# Altium project HVAMP_8CH.PrjPCB (part 2 of 3)

## Sheet power_supplies_HVAMP.SchDoc: HVAMP
size 420 x 297 mm; Author: G.Kasprowicz; CompanyName: WUT ISE; DrawnBy: G.Kasprowicz; Organization: WUT ISE; Address1: PW ISE; Address2: Nowowiejska 15/19 00-665 Warsaw; Address3: gkasprow@gmail.com; DocumentNumber: 4; Revision: 2; SheetNumber: 4; SheetTotal: 5; ModifiedBy: -; CheckedDate: -; Title2: Power supply; DivGrp: WUT ISE; Designer: G.Kasprowicz; ModifiedDate: -; ProjectName: Sensor Box
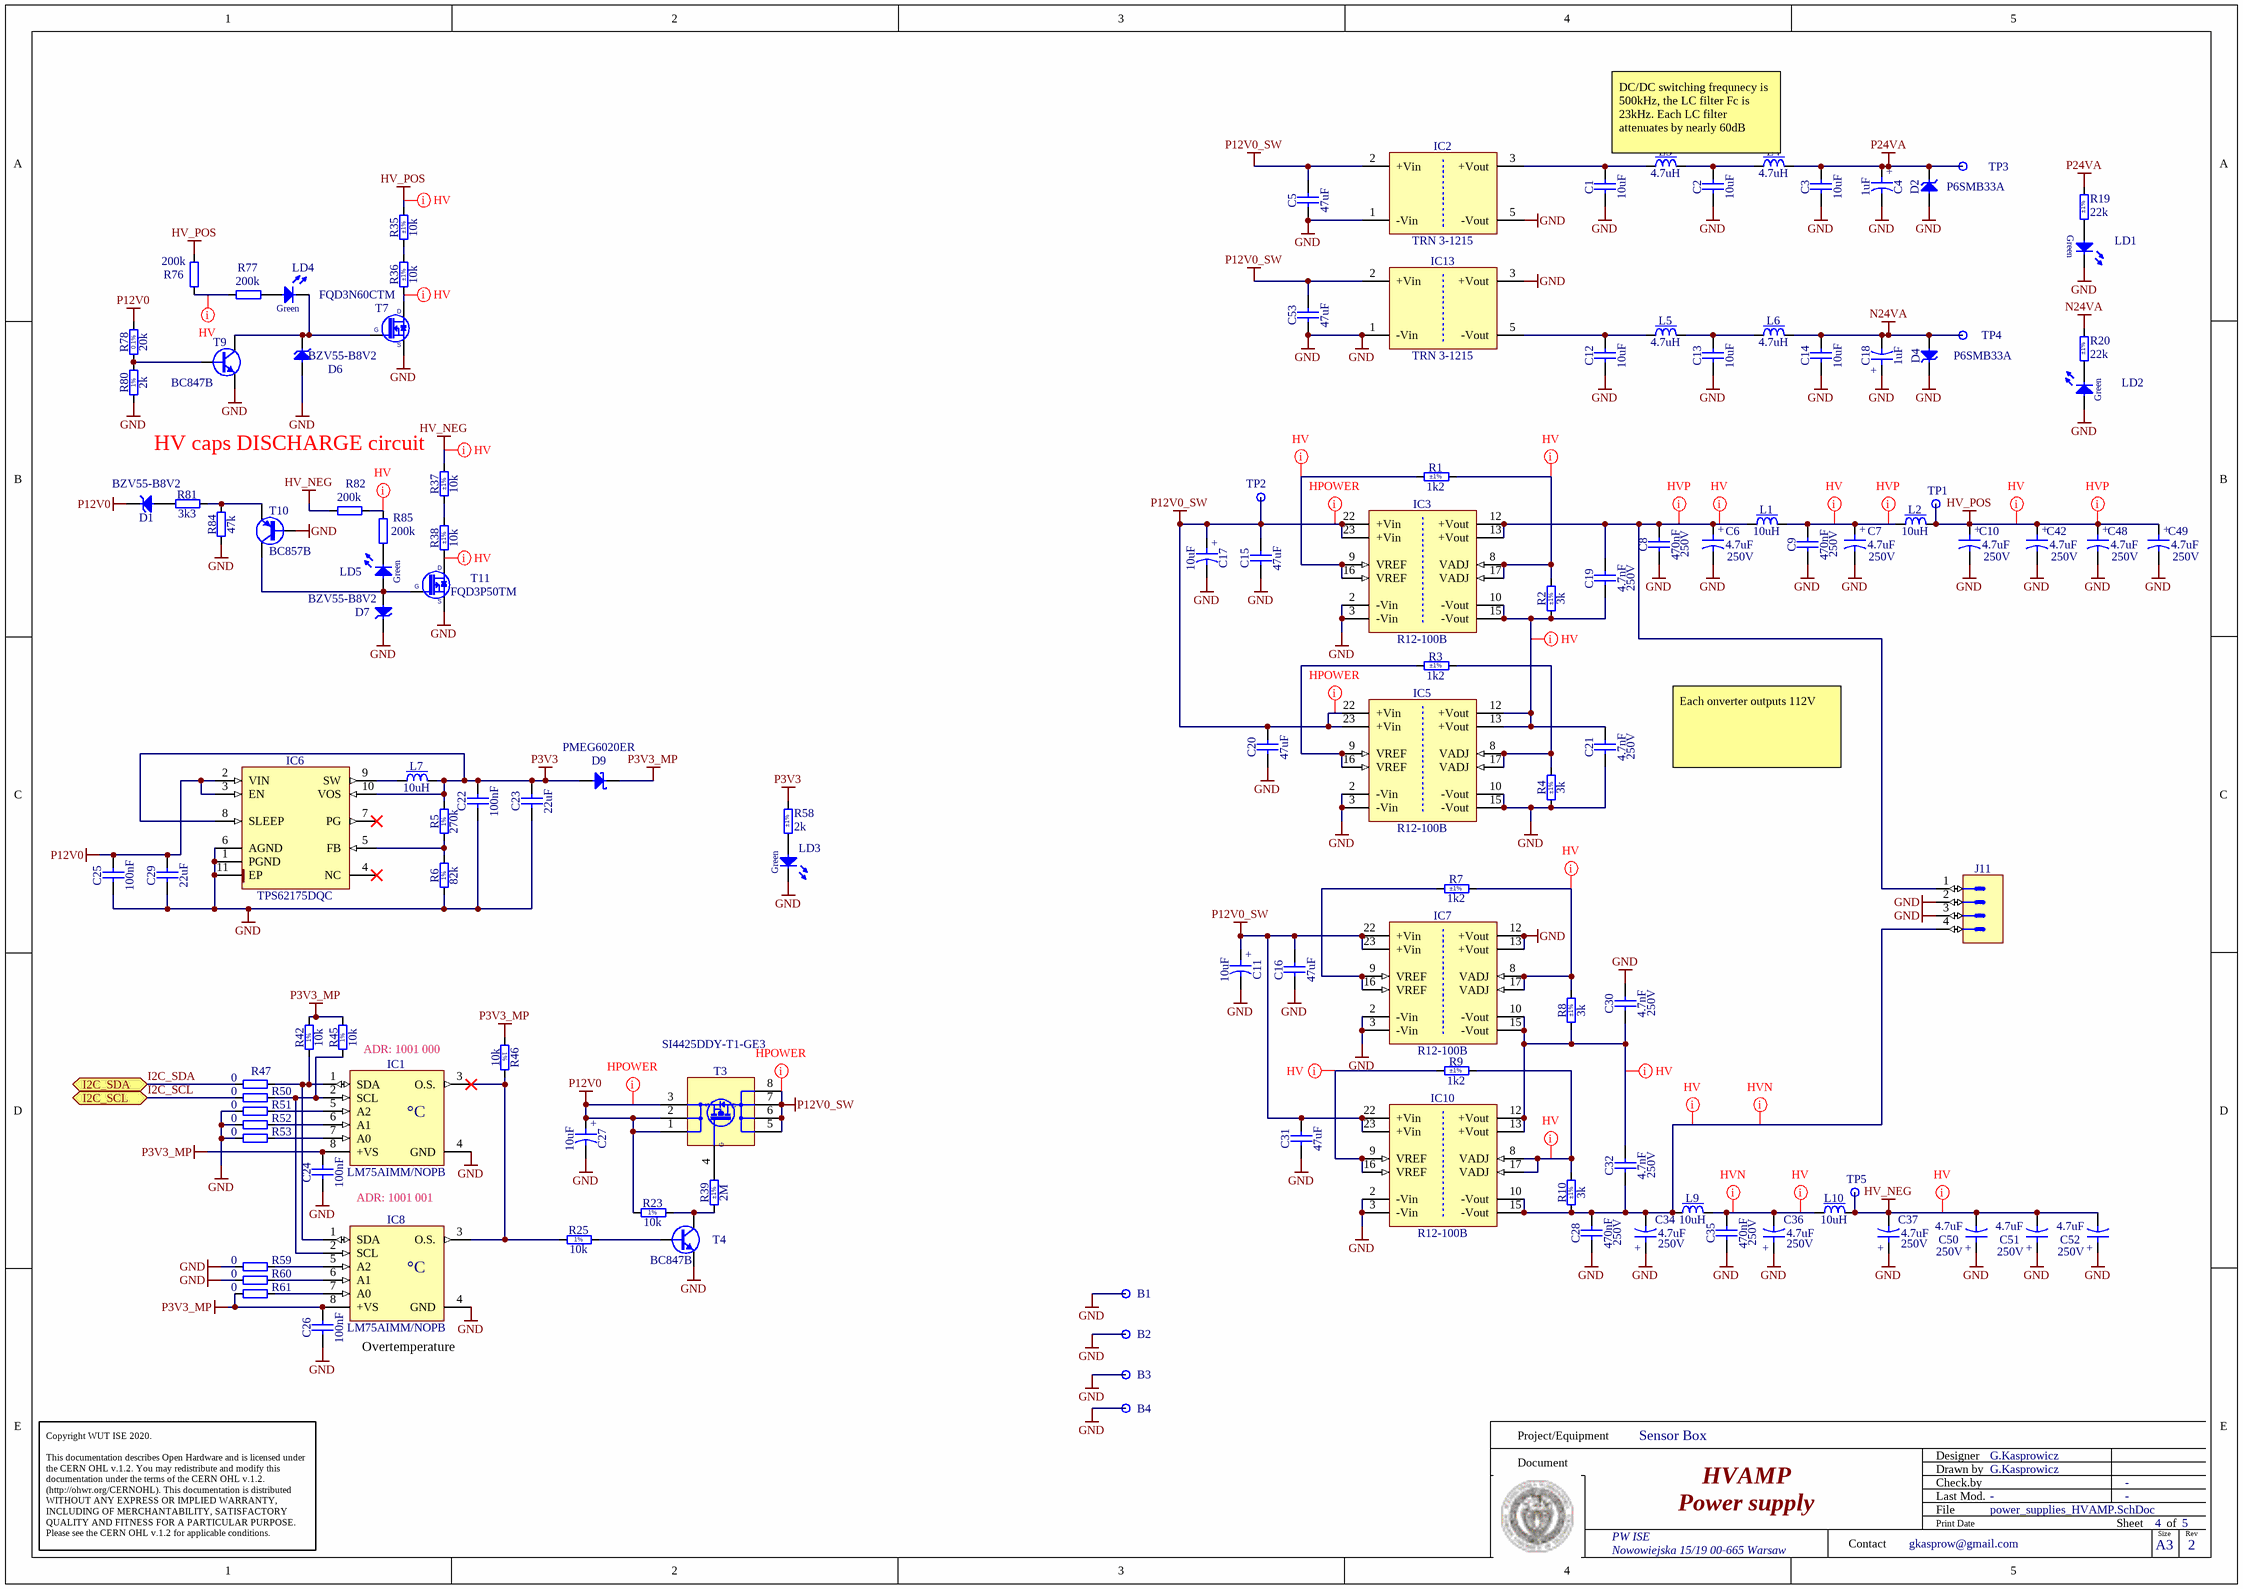
[diagram p1: power_supplies_HVAMP.SchDoc]

### Parts
B1  Plated Hole  [MTG320_700]  (value not drawn)  (no BOM)
B2  Plated Hole  [MTG320_700]  (value not drawn)  (no BOM)
B3  Plated Hole  [MTG320_700]  (value not drawn)  (no BOM)
B4  Plated Hole  [MTG320_700]  (value not drawn)  (no BOM)
C1  10uF  [CAPC2012X145N]
C2  10uF  [CAPC2012X145N]
C3  10uF  [CAPC2012X145N]
C4  1uF  [CAPMP3216X180N]
C5  47uF  [CAPC3225X270N]
C6  4.7uF  Voltage: 250V  [CAPAE9383X100M]
C7  4.7uF  Voltage: 250V  [CAPAE9383X100M]
C8  470nF  Voltage: 250V  [CAPC4532X185N]
C9  470nF  Voltage: 250V  [CAPC4532X185N]
C10  4.7uF  Voltage: 250V  [CAPAE9383X100M]
C11  10uF  [CAPMP6032X280N]
C12  10uF  [CAPC2012X145N]
C13  10uF  [CAPC2012X145N]
C14  10uF  [CAPC2012X145N]
C15  47uF  [CAPC3225X270N]
C16  47uF  [CAPC3225X270N]
C17  10uF  [CAPMP6032X280N]
C18  1uF  [CAPMP3216X180N]
C19  4.7nF  Voltage: 250V  [CAPC2012X135N]
C20  47uF  [CAPC3225X270N]
C21  4.7nF  Voltage: 250V  [CAPC2012X135N]
C22  100nF  [CAPC1005X55N]
C23  22uF  [CAPC2012X135N]
C24  100nF  [CAPC1005X55N]
C25  100nF  [CAPC1005X55N]
C26  100nF  [CAPC1005X55N]
C27  10uF  [CAPMP6032X280N]
C28  470nF  Voltage: 250V  [CAPC4532X185N]
C29  22uF  [CAPC2012X135N]
C30  4.7nF  Voltage: 250V  [CAPC2012X135N]
C31  47uF  [CAPC3225X270N]
C32  4.7nF  Voltage: 250V  [CAPC2012X135N]
C34  4.7uF  Voltage: 250V  [CAPAE9383X100M]
C35  470nF  Voltage: 250V  [CAPC4532X185N]
C36  4.7uF  Voltage: 250V  [CAPAE9383X100M]
C37  4.7uF  Voltage: 250V  [CAPAE9383X100M]
C42  4.7uF  Voltage: 250V  [CAPAE9383X100M]
C48  4.7uF  Voltage: 250V  [CAPAE9383X100M]
C49  4.7uF  Voltage: 250V  [CAPAE9383X100M]
C50  4.7uF  Voltage: 250V  [CAPAE9383X100M]
C51  4.7uF  Voltage: 250V  [CAPAE9383X100M]
C52  4.7uF  Voltage: 250V  [CAPAE9383X100M]
C53  47uF  [CAPC3225X270N]
D1  BZV55-B8V2  [DIOMELF3515N]
D2  P6SMB33A  [DIOM5436X261N]
D4  P6SMB33A  [DIOM5436X261N]
D6  BZV55-B8V2  [DIOMELF3515N]
D7  BZV55-B8V2  [DIOMELF3515N]
D9  PMEG6020ER  [SODFL3517X110N]
IC1  LM75AIMM/NOPB  [SOP65P490X109-8N]
IC2  TRN 3-1215  [DCDC_TRACO_TRN3]
IC3  R12-100B  [DCDC_RECOM_Rxx-B]
IC5  R12-100B  [DCDC_RECOM_Rxx-B]
IC6  TPS62175DQC  [SON50P200X300X80-11N-R94X250]
IC7  R12-100B  [DCDC_RECOM_Rxx-B]
IC8  LM75AIMM/NOPB  [SOP65P490X109-8N]
IC10  R12-100B  [DCDC_RECOM_Rxx-B]
IC13  TRN 3-1215  [DCDC_TRACO_TRN3]
J11  Mini-Fit Jr.™  [MOLEX_39-30-3045]  (value not drawn)
L1  10uH  [IND_MURATA-PS_8400]
L2  10uH  [IND_MURATA-PS_8400]
L3  4.7uH  [INDC2012X145N]
L4  4.7uH  [INDC2012X145N]
L5  4.7uH  [INDC2012X145N]
L6  4.7uH  [INDC2012X145N]
L7  10uH  [IND_MURATA-PS_8400]
L9  10uH  [IND_MURATA-PS_8400]
L10  10uH  [IND_MURATA-PS_8400]
LD1  Green  [LED_KINGBRIGHT_KPH-1608CGCKr]  (value not drawn)
LD2  Green  [LED_KINGBRIGHT_KPH-1608CGCKr]  (value not drawn)
LD3  Green  [LED_AVAGO_HSME-C120]
LD4  Green  [LED_KINGBRIGHT_KPH-1608CGCKr]  (value not drawn)
LD5  Green  [LED_KINGBRIGHT_KPH-1608CGCKr]  (value not drawn)
R1  1k2  Tolerance: ±1%  [RESC1608X55N]
R2  3k  Tolerance: ±1%  [RESC1608X55N]
R3  1k2  Tolerance: ±1%  [RESC1608X55N]
R4  3k  Tolerance: ±1%  [RESC1608X55N]
R5  270k  [RESC1608X55N]
R6  82k  [RESC1608X55N]
R7  1k2  Tolerance: ±1%  [RESC1608X55N]
R8  3k  Tolerance: ±1%  [RESC1608X55N]
R9  1k2  Tolerance: ±1%  [RESC1608X55N]
R10  3k  Tolerance: ±1%  [RESC1608X55N]
R19  22k  Tolerance: ±1%  [RESC1005X40N]
R20  22k  Tolerance: ±1%  [RESC1005X40N]
R23  10k  [RESC1005X40N]
R25  10k  [RESC1005X40N]
R35  10k  Tolerance: ±1%  [RESC3216X65N]
R36  10k  Tolerance: ±1%  [RESC3216X65N]
R37  10k  Tolerance: ±1%  [RESC3216X65N]
R38  10k  Tolerance: ±1%  [RESC3216X65N]
R39  2M  Tolerance: ±1%  [RESC1005X40N]
R42  10k  [RESC1005X40N]
R45  10k  [RESC1005X40N]
R46  10k  [RESC1005X40N]
R47  0  [RESC1005X40N]
R50  0  [RESC1005X40N]
R51  0  [RESC1005X40N]
R52  0  [RESC1005X40N]
R53  0  [RESC1005X40N]
R58  2k  Tolerance: ±1%  [RESC1005X40N]
R59  0  [RESC1005X40N]
R60  0  [RESC1005X40N]
R61  0  [RESC1005X40N]
R76  200k  [RESC3216X65N]
R77  200k  [RESC3216X65N]
R78  20k  [RESC1608X55N]
R80  2k  [RESC1005X40N]
R81  3k3  [RESC1005X40N]
R82  200k  [RESC3216X65N]
R84  47k  [RESC1608X55N]
R85  200k  [RESC3216X65N]
T3  SI4425DDY-T1-GE3  [SOIC127P600X175-8N]
T4  BC847B  [SOT95P230X110-3N]
T7  FQD3N60CTM  [TO228P991X239-3N-R552X520]
T9  BC847B  [SOT95P230X110-3N]
T10  BC857B  [SOT95P230X110-3N]
T11  FQD3P50TM  [TO228P991X239-3N-R552X520]
TP1  Test Point  [TPS127]  (value not drawn)
TP2  Test Point  [TPS127]  (value not drawn)
TP3  Test Point  [TPS127]  (value not drawn)
TP4  Test Point  [TPS127]  (value not drawn)
TP5  Test Point  [TPS127]  (value not drawn)

### Ports
I2C_SCL (bidir), I2C_SDA (bidir)

### Nets
GND: B1.1 B2.1 B3.1 B4.1 C1.1 C2.1 C3.1 C4.2 C5.1 C6.2 C7.2 C8.1 C9.1 C10.2 C11.2 C12.1 C13.1 C14.1 C15.1 C16.1 C17.2 C18.1 C20.1 C21.1 C22.1 C23.1 C24.1 C25.1 C26.1 C27.2 C28.1 C29.1 C30.2 C31.1 C34.1 C35.1 C36.1 C37.1 C42.2 C48.2 C49.2 C50.1 C51.1 C52.1 C53.1 D2.2(A) D4.1(C) D6.2(A) D7.1(C) IC1.4(GND) IC2.1(-Vin) IC2.5(-Vout) IC3.2(-Vin) IC3.3(-Vin) IC5.2(-Vin) IC5.3(-Vin) IC5.10(-Vout) IC5.15(-Vout) IC6.1(PGND) IC6.6(AGND) IC6.11(EP) IC7.2(-Vin) IC7.3(-Vin) IC7.12(+Vout) IC7.13(+Vout) IC8.4(GND) IC10.2(-Vin) IC10.3(-Vin) IC13.1(-Vin) IC13.3(+Vout) J11.2 J11.3 LD1.1(C) LD2.2(A) LD3.1(C) R4.1 R6.1 R51.1 R52.1 R53.1 R59.1 R60.1 R80.1 R84.1 T4.2(E) T7.2(S) T9.2(E) T10.1(B) T11.2(S)
HV_NEG: C37.2 C50.2 C51.2 C52.2 L10.2 R37.2 R82.1 TP5.1
HV_POS: C10.1 C42.1 C48.1 C49.1 L2.2 R35.2 R76.2 TP1.1
N24VA: C14.2 C18.2 D4.2(A) L6.2 R20.2 TP4.1
P3V3: C22.2 C23.2 D9.2(A) IC6.8(SLEEP) IC6.10(VOS) L7.2 R5.2 R58.2
P3V3_MP: C24.2 C26.2 D9.1(C) IC1.8(+VS) IC8.8(+VS) R42.2 R45.2 R46.1 R61.1
P12V0: C25.2 C27.1 C29.2 D1.1(C) IC6.2(VIN) IC6.3(EN) R23.1 R78.2 T3.1(S) T3.2(S) T3.3(S)
P12V0_SW: C5.2 C11.1 C15.2 C16.2 C17.1 C20.2 C31.2 C53.2 IC2.2(+Vin) IC3.22(+Vin) IC3.23(+Vin) IC5.22(+Vin) IC5.23(+Vin) IC7.22(+Vin) IC7.23(+Vin) IC10.22(+Vin) IC10.23(+Vin) IC13.2(+Vin) T3.5(D) T3.6(D) T3.7(D) T3.8(D) TP2.1
P24VA: C3.2 C4.1 D2.1(C) L4.2 R19.2 TP3.1
I2C_SCL: R50.1 ; port I2C_SCL
I2C_SDA: R47.1 ; port I2C_SDA
NetC1_2: C1.2 IC2.3(+Vout) L3.1
NetC2_2: C2.2 L3.2 L4.1
NetC6_1: C6.1 C8.2 C19.2 IC3.12(+Vout) IC3.13(+Vout) J11.1 L1.1
NetC7_1: C7.1 C9.2 L1.2 L2.1
NetC12_2: C12.2 IC13.5(-Vout) L5.1
NetC13_2: C13.2 L5.2 L6.1
NetC19_1: C19.1 C21.2 IC3.10(-Vout) IC3.15(-Vout) IC5.12(+Vout) IC5.13(+Vout) R2.1
NetC28_2: C28.2 C32.1 C34.2 IC10.10(-Vout) IC10.15(-Vout) J11.4 L9.1 R10.1
NetC30_1: C30.1 C32.2 IC7.10(-Vout) IC7.15(-Vout) IC10.12(+Vout) IC10.13(+Vout) R8.1
NetC35_2: C35.2 C36.2 L9.2 L10.1
NetD1_2: D1.2(A) R81.1
NetD6_1: D6.1(C) LD4.1(C) T7.1(G) T9.3(C)
NetD7_2: D7.2(A) LD5.2(A) T10.3(C) T11.1(G)
NetIC1_1: IC1.1(SDA) IC8.1(SDA) R42.1 R47.2
NetIC1_2: IC1.2(SCL) IC8.2(SCL) R45.1 R50.2
NetIC1_3: IC1.3(O.S.) IC8.3(O.S.) R25.1 R46.2
NetIC1_5: IC1.5(A2) R51.2
NetIC1_6: IC1.6(A1) R52.2
NetIC1_7: IC1.7(A0) R53.2
NetIC3_8: IC3.8(VADJ) IC3.17(VADJ) R1.2 R2.2
NetIC3_9: IC3.9(VREF) IC3.16(VREF) R1.1
NetIC5_8: IC5.8(VADJ) IC5.17(VADJ) R3.2 R4.2
NetIC5_9: IC5.9(VREF) IC5.16(VREF) R3.1
NetIC6_5: IC6.5(FB) R5.1 R6.2
NetIC6_9: IC6.9(SW) L7.1
NetIC7_8: IC7.8(VADJ) IC7.17(VADJ) R7.2 R8.2
NetIC7_9: IC7.9(VREF) IC7.16(VREF) R7.1
NetIC8_5: IC8.5(A2) R59.2
NetIC8_6: IC8.6(A1) R60.2
NetIC8_7: IC8.7(A0) R61.2
NetIC10_8: IC10.8(VADJ) IC10.17(VADJ) R9.2 R10.2
NetIC10_9: IC10.9(VREF) IC10.16(VREF) R9.1
NetLD1_2: LD1.2(A) R19.1
NetLD2_1: LD2.1(C) R20.1
NetLD3_2: LD3.2(A) R58.1
NetLD4_2: LD4.2(A) R77.1
NetLD5_1: LD5.1(C) R85.2
NetR23_2: R23.2 R39.1 T4.3(C)
NetR25_2: R25.2 T4.1(B)
NetR35_1: R35.1 R36.2
NetR36_1: R36.1 T7.3(D)
NetR37_1: R37.1 R38.2
NetR38_1: R38.1 T11.3(D)
NetR39_2: R39.2 T3.4(S)
NetR76_1: R76.1 R77.2
NetR78_1: R78.1 R80.2 T9.1(B)
NetR81_2: R81.2 R84.2 T10.2(E)
NetR82_2: R82.2 R85.1

Not connected (* = marked no-connect by the designer): IC6 4(NC)* 7(PG)*

### Layout directives
net class Hpower: P12V0, P12V0_SW
net class HV: HV_NEG, HV_POS, NetC6_1, NetC7_1, NetC19_1, NetC28_2, NetC30_1, NetC35_2, NetIC3_8, NetIC3_9, NetIC7_8, NetIC10_8, NetIC10_9, NetR36_1, NetR38_1, NetR76_1, NetR82_2
net class HVP: HV_POS, NetC6_1, NetC7_1
net class HVN: NetC28_2, NetC35_2

### Notes on the sheet
- DC/DC switching frequnecy is 500kHz, the LC filter Fc is 23kHz. Each LC filter attenuates by nearly 60dB
- (near R37) HV caps DISCHARGE circuit
- Each onverter outputs 112V
- ADR: 1001 000
- ADR: 1001 001
- Overtemperature
- Project/Equipment
- Document
- Designer
- Drawn by
- Check.by
- Copyright WUT ISE 2020.
  This documentation describes Open Hardware and is licensed under the CERN OHL v.1.2. You may redistribute and modify this documentation under the terms of the CERN OHL v.1.2. (http://ohwr.org/CERNOHL). This documentation is distributed WITHOUT ANY EXPRESS OR IMPLIED WARRANTY, INCLUDING OF MERCHANTABILITY, SATISFACTORY QUALITY AND FITNESS FOR A PARTICULAR PURPOSE. Please see the CERN OHL v.1.2 for applicable conditions.
- Contact
- File
- Last Mod.
- Print Date
- Sheet
- Size
- A3
- of
- Rev
- (in symbol CAP_ELECTRO_F_4.7u_250V) +
- (in symbol CTE3216-18_1UF_35V_10%) +
- (in symbol CTE6032-28_10UF_25V_10%_LESR0500) +
- (in symbol LM75AIMM/NOPB) °C
- (in symbol R0402_2K_1%_0.0625W_100PPM) 1%
- (in symbol R0402_10K_1%_0.0625W_100PPM) 1%
- (in symbol R0603_20K_0.1%_0.063W_10PPM) 0.1%
- (in symbol R0603_82K_1%_0.1W_100PPM) 1%
- (in symbol R0603_270K_1%_0.1W_100PPM) 1%
- (in symbol SI4425DDY-T1-GE3) G

### Library data of the parts
B1-B4 = PLATED_HOLE3.2_PAD7.0: Single Terminal Socket; Part Description: Plated Through Hole: Hole Dia.=3.2mm Pad Dia.=7.0mm; Mounted: No; Part Number: PLATED_HOLE3.2_PAD7.0; Component Type: Standard (No BOM); Pin Count: 1; Family: Plated Hole; Socket: No; SMD: No; Sense: No; Status: None; ComponentHeight: 0mm; HelpURL: Undefined; Author: CERN DEM JMW; CreateDate: 28.11.2017; LatestRevisionDate: 28.11.2017; PackageDescription: Plated Through Hole: Hole Dia.=3.2mm Pad Dia.=7.0mm
C1-C3 C12-C14 = CC0805_10UF_35V_10%_X5R_MURATA_GRM21BR6YA106KE43L: Non-polarised capacitor; Part Description: Chip Multilayer Ceramic Capacitor for General Purpose; Manufacturer: MURATA; Voltage: 35V; TC: X5R; Tolerance: ±10%; Part Number: CC0805_10UF_35V_10%_X5R_MURATA_GRM21BR6YA106KE43L; Component Kind: Standard; Component Type: Standard; Pin Count: 2; Value: 10uF; Status: Not Recommended; Manufacturer Part Number: GRM21BR6YA106KE43; Case: 0805; Mounted: Yes; Socket: No; SMD: Yes; Sense: No; ComponentHeight: 1.45mm; HelpURL: \\cern.ch\dfs\Applications\Altium\Datasheets\CC0805_MURATA_GRM21BR6YA106KE43L.pdf; Author: CERN DEM BC; CreateDate: 24.03.2020; LatestRevisionDate: 24.03.2020
C4 C18 = CTE3216-18_1UF_35V_10%: Polarised capacitor; Part Description: Solid Tantalum Chip Capacitor; Manufacturer: GENERIC; Manufacturer1 Part Number: TAJA105K035R; Voltage: 35V; Tolerance: ±10%; Part Number: CTE3216-18_1UF_35V_10%; Component Kind: Standard; Component Type: Standard; Pin Count: 2; Value: 1uF; Status: Preferred; Manufacturer Part Number: CTE3216-18_1UF_35V_10%; Case: A; Mounted: Yes; Socket: No; SMD: Yes; Sense: No; Manufacturer1 Example: AVX; Manufacturer1 ComponentHeight: 1.8mm; HelpURL: \\cern.ch\dfs\Applications\Altium\Datasheets\CTE_AVX_TAJ.pdf; Author: CERN DEM JLC; CreateDate: 03.12.2007; LatestRevisionDate: 03.12.2007
C5 C15 C16 C20 C31 C53 = CC1210_47UF_16V_20%_X5R: Non-polarised capacitor; Part Description: SMD Multilayer Chip Ceramic Capacitor; Manufacturer: GENERIC; Manufacturer1 Part Number: EMK325BJ476MM-T; Voltage: 16V; TC: X5R; Tolerance: ±20%; Part Number: CC1210_47UF_16V_20%_X5R; Component Kind: Standard; Component Type: Standard; Pin Count: 2; Value: 47uF; Status: None; Manufacturer Part Number: CC1210_47UF_16V_20%_X5R; Case: 1210; Mounted: Yes; Socket: No; SMD: Yes; Sense: No; Manufacturer1 Example: TAIYO YUDEN; Manufacturer1 ComponentHeight: 2.7mm; HelpURL: \\cern.ch\dfs\Applications\Altium\Datasheets\CC1210_X5R_TAIYO-YUDEN_HIGH-VALUE.pdf; Author: CERN DEM MR; CreateDate: 03.02.2016; LatestRevisionDate: 03.02.2016
C6 C7 C10 C34 C36 C37 C42 C48-C52 = CAP_ELECTRO_F_4.7u_250V: Electrolytic capacitor 4.7uF 250V; Part Number: CAE800-1000_4.7UF_250V_20%; Part Description: Aluminum Electrolytic SMT Capacitor; Manufacturer: Nichicon; Manufacturer Part Number: UUX2E4R7MNL1GS; Tolerance: ±20%; Component Kind: Standard; Component Type: Standard; Pin Count: 2; Value: 4.7uF; Status: Recommended; Case: F; Mounted: Yes; Socket: No; SMD: Yes; Sense: No; ComponentHeight: 10.2mm; HelpURL: \\cern.ch\dfs\Applications\Altium\Datasheets\CAE_PANASONIC_FK.pdf; Author: GK; CreateDate: 03.12.2007; LatestRevisionDate: 05.11.2014
C8 C9 C28 C35 = CC1812_470NF_250V_10%_X7R_FT-CAP: Non-polarised capacitor; Part Description: Flexible Termination System (FT-CAP) SMD Multilayer Ceramic  Chip Capacitor; Manufacturer: KEMET; Manufacturer Part Number: C1812X474KARACTU; TC: X7R; Tolerance: ±10%; Part Number: CC1812_470NF_250V_10%_X7R_FT-CAP; Component Kind: Standard; Component Type: Standard; Pin Count: 2; Value: 470nF; Status: None; Case: 1812; Mounted: Yes; Socket: No; SMD: Yes; Sense: No; ComponentHeight: 1.85mm; HelpURL: \\cern.ch\dfs\Applications\Altium\Datasheets\CC1812_X7R_KEMET_FT-CAP.pdf; Author: CERN DEM JLC; CreateDate: 15.09.2014; LatestRevisionDate: 15.09.2014
C11 C17 C27 = CTE6032-28_10UF_25V_10%_LESR0500: Polarised capacitor; Part Description: Low ESR 0R5 Solid Tantalum Chip Capacitor; Manufacturer: GENERIC; Manufacturer1 Part Number: TPSC106K025R0500; Voltage: 25V; Tolerance: ±10%; Part Number: CTE6032-28_10UF_25V_10%_LESR0500; Component Kind: Standard; Component Type: Standard; Pin Count: 2; Value: 10uF; Status: Preferred; Manufacturer Part Number: CTE6032-28_10UF_25V_10%_LESR0500; Case: C; Mounted: Yes; Socket: No; SMD: Yes; Sense: No; Manufacturer1 Example: AVX; Manufacturer1 ComponentHeight: 2.8mm; HelpURL: \\cern.ch\dfs\Applications\Altium\Datasheets\CTE-LESR_AVX_TPS.pdf; Author: CERN DEM JLC; CreateDate: 05/05/2008; LatestRevisionDate: 20/01/2009
C19 C21 C30 C32 = CC0805_4.7NF_250V_10%_X7R: Non-polarised capacitor; Part Description: SMD Multilayer Chip Ceramic Capacitor; Manufacturer: GENERIC; Manufacturer1 Part Number: CC0805KRX7RYBB472; TC: X7R; Tolerance: ±10%; Part Number: CC0805_4.7NF_250V_10%_X7R; Component Kind: Standard; Component Type: Standard; Pin Count: 2; Value: 4.7nF; Status: None; Manufacturer Part Number: CC0805_4.7NF_250V_10%_X7R; Case: 0805; Mounted: Yes; Socket: No; SMD: Yes; Sense: No; Manufacturer1 Example: YAGEO PHYCOMP; Manufacturer1 ComponentHeight: 1.45mm; HelpURL: \\cern.ch\dfs\Applications\Altium\Datasheets\CC0805_NP0X7R_MID-VOLTAGE_100-to-630V.pdf; Author: CERN DEM MR; CreateDate: 16.02.2016; LatestRevisionDate: 16.02.2016
C22 C24-C26 = CC0402_100NF_16V_10%_X5R: Non-polarised capacitor; Part Description: SMD Multilayer Chip Ceramic Capacitor; Manufacturer: GENERIC; Manufacturer1 Part Number: GRM155R61C104KA88D; Voltage: 16V; TC: X5R; Tolerance: ±10%; Part Number: CC0402_100NF_16V_10%_X5R; Component Kind: Standard; Component Type: Standard; Pin Count: 2; Value: 100nF; Status: None; Manufacturer Part Number: CC0402_100NF_16V_10%_X5R; Case: 0402; Mounted: Yes; Socket: No; SMD: Yes; Sense: No; Manufacturer1 Example: MURATA; Manufacturer1 ComponentHeight: 0.55mm; HelpURL: \\cern.ch\dfs\Applications\Altium\Datasheets\CC0402_X5R_MURATA_GRM.pdf; Author: CERN DEM JLC; CreateDate: 10.12.2013; LatestRevisionDate: 10.12.2013
C23 C29 = CC0805_22UF_16V_10%_X5R: Non-polarised capacitor; Part Description: SMD Multilayer Chip Ceramic Capacitor; Manufacturer: GENERIC; Manufacturer1 Part Number: C2012X5R1C226KT; Voltage: 16V; TC: X5R; Tolerance: ±10%; Part Number: CC0805_22UF_16V_10%_X5R; Component Kind: Standard; Component Type: Standard; Pin Count: 2; Value: 22uF; Status: Preferred; Manufacturer Part Number: CC0805_22UF_16V_10%_X5R; Case: 0805; Mounted: Yes; Socket: No; SMD: Yes; Sense: No; Manufacturer1 Example: TDK; Manufacturer1 ComponentHeight: 1.35mm; HelpURL: \\cern.ch\dfs\Applications\Altium\Datasheets\CC0805_X5R_TDK_C.pdf; Author: CERN DEM JLC; CreateDate: 25.10.2012; LatestRevisionDate: 25.10.2012
D1 D6 D7 = BZV55-B8V2: Zener Diode; Part Description: Voltage Regulator Diode; Manufacturer: NEXPERIA; Voltage: 8V2; Power: 500mW; PressFit: No; Bonding: No; Part Number: BZV55-B8V2; Component Kind: Standard; Component Type: Standard; Device: BZV55-B8V2; PackageDescription: SOD80C, MELF Diode, 2-Leads, Body 3.5x1.5mm, IPC Medium Density; Manufacturer Part Number: BZV55-B8V2; Pin Count: 2; Case: SOD-80C; Mounted: Yes; Socket: No; SMD: Yes; Sense: No; ComponentHeight: 1.6mm; HelpURL: \\cern.ch\dfs\Applications\Altium\Datasheets\BZV55.pdf; Author: CERN DEM JLC; CreateDate: 06.05.2008; LatestRevisionDate: 22.01.2018
D2 D4 = P6SMB33A: Transient Voltage Suppressor Diode (Uni-Directional); Part Description: Uni-directional Transient Voltage Suppressor (TVS) Diode; Manufacturer: LITTELFUSE; Voltage: 33V; Power: 600W; PressFit: No; Bonding: No; Part Number: P6SMB33A; Component Kind: Standard; Component Type: Standard; Device: P6SMB33A; PackageDescription: DO-214-AA/SMB Diode, Molded Body; 5.40mm L X 3.62mm W X 2.61mm H, IPC Medium Density; Manufacturer Part Number: P6SMB33A; Pin Count: 2; Case: SMB; Mounted: Yes; Socket: No; SMD: Yes; Sense: No; ComponentHeight: 2.61mm; HelpURL: \\cern.ch\dfs\Applications\Altium\Datasheets\P6SMB33A.pdf; Author: CERN DEM JLC; CreateDate: 25.02.2019; LatestRevisionDate: 25.02.2019
D9 = PMEG6020ER: Schottky Diode; Part Description: MEGA Schottky Barrier Rectifier; Manufacturer: NXP SEMICONDUCTORS; Voltage: 60V; Power: 2A; PressFit: No; Bonding: No; Part Number: PMEG6020ER; Component Kind: Standard; Component Type: Standard; Device: PMEG6020ER; PackageDescription: SODFL Diode (SOD123W); 2.60mm W X 1.70mm L X 1.10mm H body, IPC Medium Density; Manufacturer Part Number: PMEG6020ER; Pin Count: 2; Case: SOD123; Mounted: Yes; Socket: No; SMD: Yes; Sense: No; ComponentHeight: 0.65mm; HelpURL: \\cern.ch\dfs\Applications\Altium\Datasheets\PMEG6020ER.pdf; Author: CERN DEM JMW; CreateDate: 19.06.2014; LatestRevisionDate: 19.06.2014
IC1 IC8 = LM75AIMM/NOPB: Digital Temperature Sensor and Thermal Watchdog with Two-Wire Interface; Part Description: -25° to +100°C ±2°C Digital Temperature Sensor and Thermal Watchdog with Two-Wire Interface; Manufacturer: TEXAS INSTRUMENTS; PressFit: No; Bonding: No; Part Number: LM75AIMM/NOPB; Component Kind: Standard; Component Type: Standard; Device: LM75AIMM/NOPB; PackageDescription: SOP, 0.65mm pitch; 8 pin,3.00mm W X 3.00mm L X 1.09mm H bodyI, PC Medium Density; Manufacturer Part Number: LM75AIMM/NOPB; Pin Count: 8; Case: SSOP8; Mounted: Yes; Socket: No; SMD: Yes; Sense: No; ComponentHeight: 1.09mm; HelpURL: \\cern.ch\dfs\Applications\Altium\Datasheets\LM75AIMM-NOPB.pdf; Author: CERN DEM JLC; CreateDate: 15.10.2012; LatestRevisionDate: 15.10.2012
IC2 IC13 = DCDC_TRACO_TRN 3-0515: 9-18V DC to 24V, Iout (max) 125mA, 3W DC-DC Converter; Part Description: 18-36VDC to 24V, Iout (max) 125mA, 3W DC-DC Converter; Manufacturer: TRACO POWER; PressFit: No; Bonding: No; Part Number: TRN 3-1215; Component Kind: Standard; Component Type: Standard; Device: TRN 3-1215; PackageDescription: TRN 3 Series , Body 11.9 x 7.7mm; Manufacturer Part Number: TRN 3-1215; Pin Count: 5; Mounted: Yes; Socket: No; SMD: No; Sense: No; ComponentHeight: 11.5mm; HelpURL: \\cern.ch\dfs\Applications\Altium\Datasheets\TRN 3-2411.pdf; Author: GK; CreateDate: 14.06.2018; LatestRevisionDate: 14.06.2018
IC3 IC5 IC7 IC10 = R12-100B: RECOM, Rxx-B Series, Single Output DCDC Converter; Part Description: 10-14VDC to 50-135VDC, 3kVDC Isolated, 5W DC-DC Converter; PressFit: No; Bonding: No; Part Number: R12-100B; Component Kind: Standard; Component Type: Standard; Device: R12-100B; PackageDescription: Rxx-B Series, Body 31.8x20.3mm, DIP24 Package; Manufacturer: RECOM; Manufacturer Part Number: R12-100B; Pin Count: 12; Mounted: Yes; Socket: No; SMD: No; Sense: No; ComponentHeight: 9.9mm; HelpURL: \\cern.ch\dfs\Applications\Altium\Datasheets\R12-100B.pdf; Author: CERN DEM MR; CreateDate: 29.08.2019; LatestRevisionDate: 29.08.2019
IC6 = TPS62175DQC: 4.75-28VDC to 1-6VDC, 500mA Step-Down Converter With Sleep Mode; Manufacturer: TEXAS INSTRUMENTS; PressFit: No; Bonding: No; Part Number: TPS62175DQC; Component Kind: Standard; Component Type: Standard; Device: TPS62175DQC; PackageDescription: SON, 10-Leads, Body 2x3mm, Pitch 0.5mm, Thermal Pad 0.94x2.5mm, IPC Medium Density; Part Description: 4.75-28VDC to 1-6VDC, 500mA Step-Down Converter With Sleep Mode; Manufacturer Part Number: TPS62175DQC; Pin Count: 11; Case: SON10; Mounted: Yes; Socket: No; SMD: Yes; Sense: No; ComponentHeight: 0.8mm; HelpURL: \\cern.ch\dfs\Applications\Altium\Datasheets\TPS62175DQC.pdf; Author: CERN DEM JMW; CreateDate: 11.08.2015; LatestRevisionDate: 11.08.2015
J11 = MOLEX_39-30-3045: Connector 4 Male; Part Description: 4.20mm (.165") Pitch Mini-Fit Jr. Header, Single Row, Right Angle, with Snap-in Plastic Peg PCB Lock, 4 Circuits; Manufacturer: MOLEX; PressFit: No; Part Number: MOLEX_39-30-3045; Component Kind: Standard; Component Type: Standard; Pin Count: 4; Family: Mini-Fit Jr.™; Mounted: Yes; Socket: No; SMD: No; Sense: No; Status: None; Manufacturer Part Number: 39-30-3045; ComponentHeight: 7.2mm; HelpURL: \\cern.ch\dfs\Applications\Altium\Datasheets\MOLEX_39-30-3045.pdf; Author: CERN DEM JLC; CreateDate: 15.07.2013; LatestRevisionDate: 15.07.2013
L1 L2 L7 L9 L10 = IND_10UH_10%_MURATA-PS_8400: Inductor With Core; Part Description: Miniature Surface Mount Power Inductor (8400 Serie); Manufacturer: MURATA POWER SOLUTIONS; Manufacturer Part Number: 84103C; Power: 950mA; Resistance: 0.24R; Tolerance: ±10%; Part Number: IND_10UH_10%_MURATA-PS_8400; Component Kind: Standard; Component Type: Standard; Pin Count: 2; Value: 10uH; Status: None; Mounted: Yes; Socket: No; SMD: Yes; Sense: No; ComponentHeight: 2.9mm; HelpURL: \\cern.ch\dfs\Applications\Altium\Datasheets\IND_MURATA-PS_8400.pdf; Author: CERN DEM JLC; CreateDate: 02.07.2012; LatestRevisionDate: 02.07.2012
L3-L6 = IND0805_4.7UH_20%_TAIYO-YUDEN_CB: Inductor With Core; Part Description: Wound Chip Power Inductors (CB Series); Manufacturer: TAIYO YUDEN; Manufacturer Part Number: CB2012T4R7M; Power: 300mA; Resistance: 0.4R; Tolerance: ±20%; Part Number: IND0805_4.7UH_20%_TAIYO-YUDEN_CB; Component Kind: Standard; Component Type: Standard; Pin Count: 2; Value: 4.7uH; Status: None; Case: 0805; Mounted: Yes; Socket: No; SMD: Yes; Sense: No; ComponentHeight: 1.45mm; HelpURL: \\cern.ch\dfs\Applications\Altium\Datasheets\IND0805_TAIYO-YUDEN_CB.pdf; Author: CERN DEM JLC; CreateDate: 15.11.2010; LatestRevisionDate: 15.11.2010
LD1 LD2 LD4 LD5 = LED_0603_Green: Green 0603; Part Number: LED_KINGBRIGHT_KPH-1608CGCK; Part Description: SMD Green LED, Case 1.6mmX0.8mm(0603), 0.65mm Thickness; Manufacturer: KINGBRIGHT; Manufacturer Part Number: KPH-1608CGCK; PressFit: No; Bonding: No; Component Kind: Standard; Component Type: Standard; Color: Green; Footprint: LED_KINGBRIGHT_KPH-1608CGCK; PackageDescription: SMT Green LED, Case 0603, Body L 1.6 x W 0.8mm H 0.65mm; Pin Count: 2; Mounted: Yes; Socket: No; SMD: Yes; Sense: No; ComponentHeight: 0.65mm; HelpURL: \\cern.ch\dfs\Applications\Altium\Datasheets\LED_KINGBRIGHT_KPH-1608CGCK.pdf; Author: CERN DEM JLC; CreateDate: 03.07.2017; LatestRevisionDate: 03.07.2017
LD3 = LED_AVAGO_HSME-C120: LED Green 1C 2A; Part Description: High Performance Right Angle Chip Green LED; Manufacturer: AVAGO TECHNOLOGIES; PressFit: No; Bonding: No; Part Number: LED_AVAGO_HSME-C120; Component Kind: Standard; Component Type: Standard; Color: Green; PackageDescription: Green Chip LED, 2-Leads, Body 1.7x1.1mm, Side Emitting Package; Manufacturer Part Number: HSME-C120; Pin Count: 2; Mounted: Yes; Socket: No; SMD: Yes; Sense: No; ComponentHeight: 0.7mm; HelpURL: \\cern.ch\dfs\Applications\Altium\Datasheets\LED_AVAGO_HSME-C120.pdf; ComponentLink1URL: \\cern.ch\dfs\Applications\Altium\Datasheets\LED_AVAGO_HSME-C110_DESIGN-GUIDE.pdf; ComponentLink1Description: Design Guide; Author: CERN DEM JMW; CreateDate: 22.07.2009; LatestRevisionDate: 20.06.2012
R1 R3 R7 R9 = R0603_1K2_1%_0.1W_100PPM: Resistor - 1%; Part Description: General Purpose Thick Film Chip Resistor; Manufacturer: GENERIC; Manufacturer1 Part Number: NRC06F1201TRF; Power: 0.1W; TC: ±100ppm/°C; PressFit: No; Part Number: R0603_1K2_1%_0.1W_100PPM; Component Kind: Standard; Component Type: Standard; Pin Count: 2; Value: 1k2; Status: Preferred; Manufacturer Part Number: R0603_1K2_1%_0.1W_100PPM; Case: 0603; Mounted: Yes; Sense: No; Socket: No; SMD: Yes; Manufacturer1 Example: NIC COMPONENT; Manufacturer1 ComponentHeight: 0.55mm; HelpURL: \\cern.ch\dfs\Applications\Altium\Datasheets\R0603_NIC_NRC.pdf; Author: CERN DEM JLC; CreateDate: 03.12.2007; LatestRevisionDate: 13.03.2008
R2 R4 R8 R10 = R0603_3k_1%_0.1W_100PPM: Resistor - 1%; Part Description: General Purpose Thick Film Chip Resistor; Manufacturer: GENERIC; Manufacturer1 Part Number: NRC06F3001TRF; Power: 0.1W; TC: ±100ppm/°C; PressFit: No; Part Number: R0603_3K_1%_0.1W_100PPM; Component Kind: Standard; Component Type: Standard; Pin Count: 2; Value: 3k; Status: Preferred; Manufacturer Part Number: R0603_3K_1%_0.1W_100PPM; Case: 0603; Mounted: Yes; Sense: No; Socket: No; SMD: Yes; Manufacturer1 Example: NIC COMPONENT; Manufacturer1 ComponentHeight: 0.55mm; HelpURL: \\cern.ch\dfs\Applications\Altium\Datasheets\R0603_NIC_NRC.pdf; Author: CERN DEM JLC; CreateDate: 03.12.2007; LatestRevisionDate: 13.03.2008
R5 = R0603_270K_1%_0.1W_100PPM: Resistor - 1%; Part Description: General Purpose Thick Film Chip Resistor; Manufacturer: GENERIC; Manufacturer1 Part Number: NRC06F2703TRF; Power: 0.1W; TC: ±100ppm/°C; Part Number: R0603_270K_1%_0.1W_100PPM; Component Kind: Standard; Component Type: Standard; Pin Count: 2; Value: 270k; Status: Preferred; Tolerance: ±1%; Manufacturer Part Number: R0603_270K_1%_0.1W_100PPM; Case: 0603; Mounted: Yes; Sense: No; Socket: No; SMD: Yes; Manufacturer1 Example: NIC COMPONENT; Manufacturer1 ComponentHeight: 0.55mm; HelpURL: \\cern.ch\dfs\Applications\Altium\Datasheets\R0603_NIC_NRC.pdf; Author: CERN DEM JLC; CreateDate: 03.12.2007; LatestRevisionDate: 13.03.2008
R6 = R0603_82K_1%_0.1W_100PPM: Resistor - 1%; Part Description: General Purpose Thick Film Chip Resistor; Manufacturer: GENERIC; Manufacturer1 Part Number: NRC06F8202TRF; Power: 0.1W; TC: ±100ppm/°C; Part Number: R0603_82K_1%_0.1W_100PPM; Component Kind: Standard; Component Type: Standard; Pin Count: 2; Value: 82k; Status: Preferred; Tolerance: ±1%; Manufacturer Part Number: R0603_82K_1%_0.1W_100PPM; Case: 0603; Mounted: Yes; Sense: No; Socket: No; SMD: Yes; Manufacturer1 Example: NIC COMPONENT; Manufacturer1 ComponentHeight: 0.55mm; HelpURL: \\cern.ch\dfs\Applications\Altium\Datasheets\R0603_NIC_NRC.pdf; Author: CERN DEM JLC; CreateDate: 03.12.2007; LatestRevisionDate: 13.03.2008
R19 R20 = R0402_22K_1%_0.0625W_100PPM: Resistor - 1%; Part Description: General Purpose Thick Film Chip Resistor; Manufacturer: GENERIC; Manufacturer1 Part Number: 232270672203L; TC: ±100ppm/°C; PressFit: No; Part Number: R0402_22K_1%_0.0625W_100PPM; Component Kind: Standard; Component Type: Standard; Pin Count: 2; Value: 22k; Status: Not Recommended; Power: 0.0625W; Manufacturer Part Number: R0402_22K_1%_0.0625W_100PPM; Case: 0402; Mounted: Yes; Sense: No; Socket: No; SMD: Yes; Manufacturer1 Example: YAGEO PHYCOMP; Manufacturer1 ComponentHeight: 0.4mm; HelpURL: \\cern.ch\dfs\Applications\Altium\Datasheets\R0402_Phycomp_RC0402.pdf; Author: CERN DEM JLC; CreateDate: 03.12.2007; LatestRevisionDate: 17.10.2012
R23 R25 R42 R45 R46 = R0402_10K_1%_0.0625W_100PPM: Resistor - 1%; Part Description: General Purpose Thick Film Chip Resistor; Manufacturer: GENERIC; Manufacturer1 Part Number: 232270671003L; TC: ±100ppm/°C; PressFit: No; Part Number: R0402_10K_1%_0.0625W_100PPM; Component Kind: Standard; Component Type: Standard; Pin Count: 2; Value: 10k; Status: Not Recommended; Power: 0.0625W; Tolerance: ±1%; Manufacturer Part Number: R0402_10K_1%_0.0625W_100PPM; Case: 0402; Mounted: Yes; Sense: No; Socket: No; SMD: Yes; Manufacturer1 Example: YAGEO PHYCOMP; Manufacturer1 ComponentHeight: 0.4mm; HelpURL: \\cern.ch\dfs\Applications\Altium\Datasheets\R0402_Phycomp_RC0402.pdf; Author: CERN DEM JLC; CreateDate: 03.12.2007; LatestRevisionDate: 17.10.2012
R35-R38 = R1206_10K_1%_0.25W_100PPM: Resistor - 1%; Part Description: General Purpose Thick Film Chip Resistor; Manufacturer: GENERIC; Manufacturer1 Part Number: NRC12F1002TRF; Power: 0.25W; TC: ±100ppm/°C; PressFit: No; Part Number: R1206_10K_1%_0.25W_100PPM; Component Kind: Standard; Component Type: Standard; Pin Count: 2; Value: 10k; Status: Preferred; Manufacturer Part Number: R1206_10K_1%_0.25W_100PPM; Case: 1206; Mounted: Yes; Sense: No; Socket: No; SMD: Yes; Manufacturer1 Example: NIC COMPONENT; Manufacturer1 ComponentHeight: 0.65mm; HelpURL: \\cern.ch\dfs\Applications\Altium\Datasheets\R1206_NIC_NRC.pdf; Author: CERN DEM JLC; CreateDate: 03.12.2007; LatestRevisionDate: 13.03.2008
R39 = R0402_2M_1%_0.0625W_100PPM: Resistor - 1%; Part Description: General Purpose Thick Film Chip Resistor; Manufacturer: GENERIC; Manufacturer1 Part Number: 232270672005L; TC: ±100ppm/°C; PressFit: No; Part Number: R0402_2M_1%_0.0625W_100PPM; Component Kind: Standard; Component Type: Standard; Pin Count: 2; Value: 2M; Status: Not Recommended; Power: 0.0625W; Manufacturer Part Number: R0402_2M_1%_0.0625W_100PPM; Case: 0402; Mounted: Yes; Sense: No; Socket: No; SMD: Yes; Manufacturer1 Example: YAGEO PHYCOMP; Manufacturer1 ComponentHeight: 0.4mm; HelpURL: \\cern.ch\dfs\Applications\Altium\Datasheets\R0402_Phycomp_RC0402.pdf; Author: CERN DEM JLC; CreateDate: 03.12.2007; LatestRevisionDate: 17.10.2012
R47 R50-R53 R59-R61 = R0402_0R_JUMPER: Resistor; Part Description: 1A (0.05R Max DC Resistance) Zero Ohm Jumper; Manufacturer: GENERIC; Manufacturer1 Part Number: 232270591001L; Part Number: R0402_0R_JUMPER; Component Kind: Standard; Component Type: Standard; Pin Count: 2; Value: 0; Status: Not recommended; Manufacturer Part Number: R0402_0R_JUMPER; Case: 0402; Mounted: Yes; Sense: No; Socket: No; SMD: Yes; Manufacturer1 Example: YAGEO PHYCOMP; Manufacturer1 ComponentHeight: 0.4mm; HelpURL: \\cern.ch\dfs\Applications\Altium\Datasheets\R0402_Phycomp_RC0402.pdf; Author: CERN DEM JLC; CreateDate: 03.12.2007; LatestRevisionDate: 17.10.2012
R58 R80 = R0402_2K_1%_0.0625W_100PPM: Resistor - 1%; Part Description: General Purpose Thick Film Chip Resistor; Manufacturer: GENERIC; Manufacturer1 Part Number: 232270672002L; TC: ±100ppm/°C; PressFit: No; Part Number: R0402_2K_1%_0.0625W_100PPM; Component Kind: Standard; Component Type: Standard; Pin Count: 2; Value: 2k; Status: Not Recommended; Power: 0.0625W; Manufacturer Part Number: R0402_2K_1%_0.0625W_100PPM; Case: 0402; Mounted: Yes; Sense: No; Socket: No; SMD: Yes; Manufacturer1 Example: YAGEO PHYCOMP; Manufacturer1 ComponentHeight: 0.4mm; HelpURL: \\cern.ch\dfs\Applications\Altium\Datasheets\R0402_Phycomp_RC0402.pdf; Author: CERN DEM JLC; CreateDate: 03.12.2007; LatestRevisionDate: 17.10.2012
  R80: Tolerance: ±1%
R76 R77 R82 R85 = R1206_200K_1%_0.25W_100PPM: Resistor - 1%; Part Description: General Purpose Thick Film Chip Resistor; Manufacturer: GENERIC; Manufacturer1 Part Number: NRC12F2003TRF; Power: 0.25W; TC: ±100ppm/°C; PressFit: No; Part Number: R1206_200K_1%_0.25W_100PPM; Component Kind: Standard; Component Type: Standard; Pin Count: 2; Value: 200k; Status: Preferred; Tolerance: ±1%; Manufacturer Part Number: R1206_200K_1%_0.25W_100PPM; Case: 1206; Mounted: Yes; Sense: No; Socket: No; SMD: Yes; Manufacturer1 Example: NIC COMPONENT; Manufacturer1 ComponentHeight: 0.65mm; HelpURL: \\cern.ch\dfs\Applications\Altium\Datasheets\R1206_NIC_NRC.pdf; Author: CERN DEM JLC; CreateDate: 03.12.2007; LatestRevisionDate: 13.03.2008
R78 = R0603_20K_0.1%_0.063W_10PPM: Resistor - 0.1%; Part Description: Thin Film Chip Resistor; Manufacturer: GENERIC; Manufacturer1 Part Number: RN73C1J20KBTDF; Power: 0.063W; TC: ±10ppm; PressFit: No; Part Number: R0603_20K_0.1%_0.063W_10PPM; Component Kind: Standard; Component Type: Standard; Pin Count: 2; Value: 20k; Status: Not Recommended; Tolerance: ±0.1%; Manufacturer Part Number: R0603_20K_0.1%_0.063W_10PPM; Case: 0603; Mounted: Yes; Sense: No; Socket: No; SMD: Yes; Manufacturer1 Example: TYCO HOLSWORTHY; Manufacturer1 ComponentHeight: 0.5mm; HelpURL: \\cern.ch\dfs\Applications\Altium\Datasheets\R0603_Tyco_RN73.pdf; Author: CERN DEM JLC; CreateDate: 03.12.2007; LatestRevisionDate: 13.03.2008
R81 = R0402_3K3_1%_0.0625W_100PPM: Resistor - 1%; Part Description: General Purpose Thick Film Chip Resistor; Manufacturer: GENERIC; Manufacturer1 Part Number: 232270673302L; TC: ±100ppm/°C; PressFit: No; Part Number: R0402_3K3_1%_0.0625W_100PPM; Component Kind: Standard; Component Type: Standard; Pin Count: 2; Value: 3k3; Status: Not Recommended; Power: 0.0625W; Tolerance: ±1%; Manufacturer Part Number: R0402_3K3_1%_0.0625W_100PPM; Case: 0402; Mounted: Yes; Sense: No; Socket: No; SMD: Yes; Manufacturer1 Example: YAGEO PHYCOMP; Manufacturer1 ComponentHeight: 0.4mm; HelpURL: \\cern.ch\dfs\Applications\Altium\Datasheets\R0402_Phycomp_RC0402.pdf; Author: CERN DEM JLC; CreateDate: 03.12.2007; LatestRevisionDate: 17.10.2012
R84 = R0603_47K_1%_0.1W_100PPM: Resistor - 1%; Part Description: General Purpose Thick Film Chip Resistor; Manufacturer: GENERIC; Manufacturer1 Part Number: NRC06F4702TRF; Power: 0.1W; TC: ±100ppm/°C; PressFit: No; Part Number: R0603_47K_1%_0.1W_100PPM; Component Kind: Standard; Component Type: Standard; Pin Count: 2; Value: 47k; Status: Preferred; Tolerance: ±1%; Manufacturer Part Number: R0603_47K_1%_0.1W_100PPM; Case: 0603; Mounted: Yes; Sense: No; Socket: No; SMD: Yes; Manufacturer1 Example: NIC COMPONENT; Manufacturer1 ComponentHeight: 0.55mm; HelpURL: \\cern.ch\dfs\Applications\Altium\Datasheets\R0603_NIC_NRC.pdf; Author: CERN DEM JLC; CreateDate: 03.12.2007; LatestRevisionDate: 13.03.2008
T3 = SI4425DDY-T1-GE3: -30V -19.7A P-Channel MOSFET; Manufacturer: VISHAY SILICONIX; PressFit: No; Bonding: No; Part Number: SI4425DDY-T1-GE3; Component Kind: Standard; Component Type: Standard; Device: SI4425DDY-T1-GE3; PackageDescription: SOIC 8, Pitch 1.27mm - Body 4x5mm, IPC Medium Density; Part Description: -30V -19.7A P-Channel MOSFET; Manufacturer Part Number: SI4425DDY-T1-GE3; Pin Count: 8; Case: SOIC8; Mounted: Yes; Socket: No; SMD: Yes; Sense: No; ComponentHeight: 1.75mm; HelpURL: \\cern.ch\dfs\Applications\Altium\Datasheets\SI4425DDY-T1-GE3.pdf; Author: CERN DEM MR; CreateDate: 05/10/2016; LatestRevisionDate: 05/10/2016
T4 T9 = BC847B: NPN Transistor; Part Description: 45V 100mA NPN general-purpose transistors; Manufacturer: NXP SEMICONDUCTORS; PressFit: No; Bonding: No; Part Number: BC847B; Component Kind: Standard; Component Type: Standard; Device: BC847B; PackageDescription: SOT23, 3 pin, Pitch 0.95mm - 1.3mm W X 2.9mm L X 1.1mm H, IPC Medium Density; Manufacturer Part Number: BC847B; Pin Count: 3; Case: SOT23-3; Mounted: Yes; Socket: No; SMD: Yes; Sense: No; ComponentHeight: 1.1mm; HelpURL: \\cern.ch\dfs\Applications\Altium\Datasheets\BC847B.pdf; Author: CERN DEM JLC; CreateDate: 14.06.2011; LatestRevisionDate: 14.06.2011
T7 = Q_FQD3N60CTM: N-CHANNEL 600V, 2.4A, 3.4Ohm; Part Description: 600V 2.4A N-Channel Power MOSFET; Manufacturer: ONSEMI; PressFit: No; Bonding: No; Part Number: FQD3N60CTM; Component Kind: Standard; Component Type: Standard; Device: FQD3N60CTM; PackageDescription: TO-252AA DPAK TO, 2.28mm pitch; 2 pin,9.905mm L X 6.095mm W X 2.39mm H body, IPC Medium Density; Manufacturer Part Number: FQD3N60CTM; Pin Count: 3; Case: DPAK; Mounted: Yes; Socket: No; SMD: Yes; Sense: No; ComponentHeight: 2.38mm; HelpURL: \\cern.ch\dfs\Applications\Altium\Datasheets\IRFR224PBF.pdf; Author: GK; CreateDate: 25.07.2012; LatestRevisionDate: 25.07.2012
T10 = BC857B: PNP Transistor; Part Description: 45V 100mA PNP general-purpose transistors; Manufacturer: NXP SEMICONDUCTORS; PressFit: No; Bonding: No; Part Number: BC857B; Component Kind: Standard; Component Type: Standard; Device: BC857B; PackageDescription: SOT23, 3 pin, Pitch 0.95mm - 1.3mm W X 2.9mm L X 1.1mm H, IPC Medium Density; Manufacturer Part Number: BC857B; Pin Count: 3; Case: SOT23-3; Mounted: Yes; Socket: No; SMD: Yes; Sense: No; ComponentHeight: 1.1mm; HelpURL: \\cern.ch\dfs\Applications\Altium\Datasheets\BC857B.pdf; Author: CERN DEM JLC; CreateDate: 14.06.2011; LatestRevisionDate: 14.06.2011
T11 = Q_FQD3P50TM: P-CHANNEL -500V, -2.1A 4.9Ohm; Part Description: -500V -2.1A P-Channel Power MOSFET; Manufacturer: ONSEMI; PressFit: No; Bonding: No; Part Number: FQD3P50TM; Component Kind: Standard; Component Type: Standard; Device: FQD3P50TM; PackageDescription: TO-252AA DPAK TO, 2.28mm pitch; 2 pin,9.905mm L X 6.095mm W X 2.39mm H body, IPC Medium Density; Manufacturer Part Number: FQD3P50TM; Pin Count: 3; Case: DPAK; Mounted: Yes; Socket: No; SMD: Yes; Sense: No; ComponentHeight: 2.38mm; HelpURL: \\cern.ch\dfs\Applications\Altium\Datasheets\IRFR9220PBF.pdf; Author: GK; CreateDate: 18.03.2013; LatestRevisionDate: 18.03.2013
TP1-TP5 = SMD_PAD_1.27X1.27MM: Part Description: 1.27mm x 1.27mm PCB Copper Area (SMD Test Point); Mounted: No; Part Number: SMD_PAD_1.27X1.27MM; Component Kind: Standard (No BOM); Component Type: Standard (No BOM); Pin Count: 1; Family: Test Point; Socket: No; SMD: Yes; Sense: No; Status: None; ComponentHeight: 0mm; HelpURL: Undefined; Author: CERN DEM JLC; CreateDate: 12/01/2008; LatestRevisionDate: 12/01/2008; PackageDescription: 1.27mm x 1.27mm PCB Copper Area (SMD Test Point)

## Sheet mechanics.SchDoc: HVAMP
size 420 x 297 mm; Author: G.Kasprowicz; CompanyName: WUT ISE; DrawnBy: G.Kasprowicz; Organization: WUT ISE; Address1: PW ISE; Address2: Nowowiejska 15/19 00-665 Warsaw; Address3: gkasprow@gmail.com; DocumentNumber: 5; Revision: 2; SheetNumber: 5; SheetTotal: 5; ModifiedBy: -; CheckedDate: -; Title2: mechanics; DivGrp: WUT ISE; Designer: G.Kasprowicz; ModifiedDate: -; ProjectName: Sensor Box
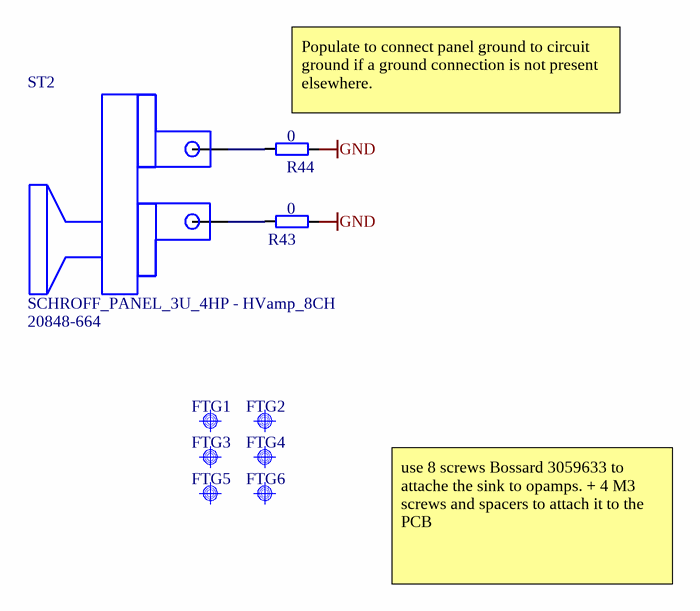
[diagram p2: mechanics.SchDoc]

### Parts
FTG1  Use only in PCB  [FIDUCIAL_TOP_C100-200]  (value not drawn)
FTG2  Use only in PCB  [FIDUCIAL_TOP_C100-200]  (value not drawn)
FTG3  Use only in PCB  [FIDUCIAL_TOP_C100-200]  (value not drawn)
FTG4  Use only in PCB  [FIDUCIAL_TOP_C100-200]  (value not drawn)
FTG5  Use only in PCB  [FIDUCIAL_TOP_C100-200]  (value not drawn)
FTG6  Use only in PCB  [FIDUCIAL_TOP_C100-200]  (value not drawn)
R43  0  [RESC1608X55N]
R44  0  [RESC1608X55N]
ST2  SCHROFF_PANEL_3U_4HP - HVamp_8CH  Manufacturer Part Number 2: 20848-664  [SCHROFF_PANEL_3U_4HP - HVamp_8CH]

### Nets
GND: R43.1 R44.1
NetR43_2: R43.2 ST2.0
NetR44_2: R44.2 ST2.1

### Notes on the sheet
- (near R44) Populate to connect panel ground to circuit ground if a ground connection is not present elsewhere.
- use 8 screws Bossard 3059633 to attache the sink to opamps. + 4 M3 screws and spacers to attach it to the PCB
- Project/Equipment
- Document
- Designer
- Drawn by
- Check.by
- Copyright WUT ISE 2020.
  This documentation describes Open Hardware and is licensed under the CERN OHL v.1.2. You may redistribute and modify this documentation under the terms of the CERN OHL v.1.2. (http://ohwr.org/CERNOHL). This documentation is distributed WITHOUT ANY EXPRESS OR IMPLIED WARRANTY, INCLUDING OF MERCHANTABILITY, SATISFACTORY QUALITY AND FITNESS FOR A PARTICULAR PURPOSE. Please see the CERN OHL v.1.2 for applicable conditions.
- Contact
- File
- Last Mod.
- Print Date
- Sheet
- Size
- A3
- of
- Rev

### Library data of the parts
FTG1-FTG6 = FIDUCIAL_TARGET_C100-200: Fiducial Target; Part Description: Round Fiducial Target, Top Layer, 1.0mm, Top Solder 2.0mm, Keepout =2.0mm; Mounted: No; Part Number: FIDUCIAL_TARGET_C100-200; Component Kind: Standard (No BOM); Component Type: Standard (No BOM); Pin Count: 1; Family: Fiducial; Socket: No; SMD: Yes; Sense: No; Status: None; ComponentHeight: 0mm; HelpURL: Undefined; Author: CERN DEM JLC; CreateDate: 09/02/2010; LatestRevisionDate: 04/04/2012; PackageDescription: Round Fiducial Target, Top Layer, 1.0mm, Top Solder 2.0mm, Keepout =2.0mm
R43 R44 = R0603_0R_JUMPER: Resistor; Part Description: 1A (0.05R Max DC Resistance) Zero Ohm Jumper; Manufacturer: GENERIC; Manufacturer1 Part Number: NRC06Z0; PressFit: No; Part Number: R0603_0R_JUMPER; Component Kind: Standard; Component Type: Standard; Pin Count: 2; Value: 0; Status: Preferred; Manufacturer Part Number: R0603_0R_JUMPER; Case: 0603; Mounted: Yes; Sense: No; Socket: No; SMD: Yes; Manufacturer1 Example: NIC COMPONENT; Manufacturer1 ComponentHeight: 0.55mm; HelpURL: \\cern.ch\dfs\Applications\Altium\Datasheets\R0603_NIC_NRC.pdf; Author: CERN DEM JLC; CreateDate: 03/12/2007; LatestRevisionDate: 13/03/2008
ST2 = SCHROFF_PANEL_3U_4HP - HVamp_8CH: Schroff 3HP 4U EUROCARD Panel; Manufacturer Part Number: 20818-017; Manufacturer: Schroff

## Sheet LVDS_IFC_HVAMP.SchDoc: LVDS
size 420 x 297 mm; EDA_Number: ARTIQ; Projet: Zotino; Author: G.Kasprowicz; CompanyName: WUT ISE; DrawnBy: G.Kasprowicz; Organization: WUT ISE; Address1: PW ISE; Address2: Nowowiejska 15/19 00-665 Warsaw; Address3: gkasprow@gmail.com; DocumentNumber: 3; Revision: 2; SheetNumber: 3; SheetTotal: 5; ModifiedBy: -; CheckedDate: -; Title2: Interface; DivGrp: WUT ISE; Designer: G.Kasprowicz; ModifiedDate: -; ProjectName: Sensor Box
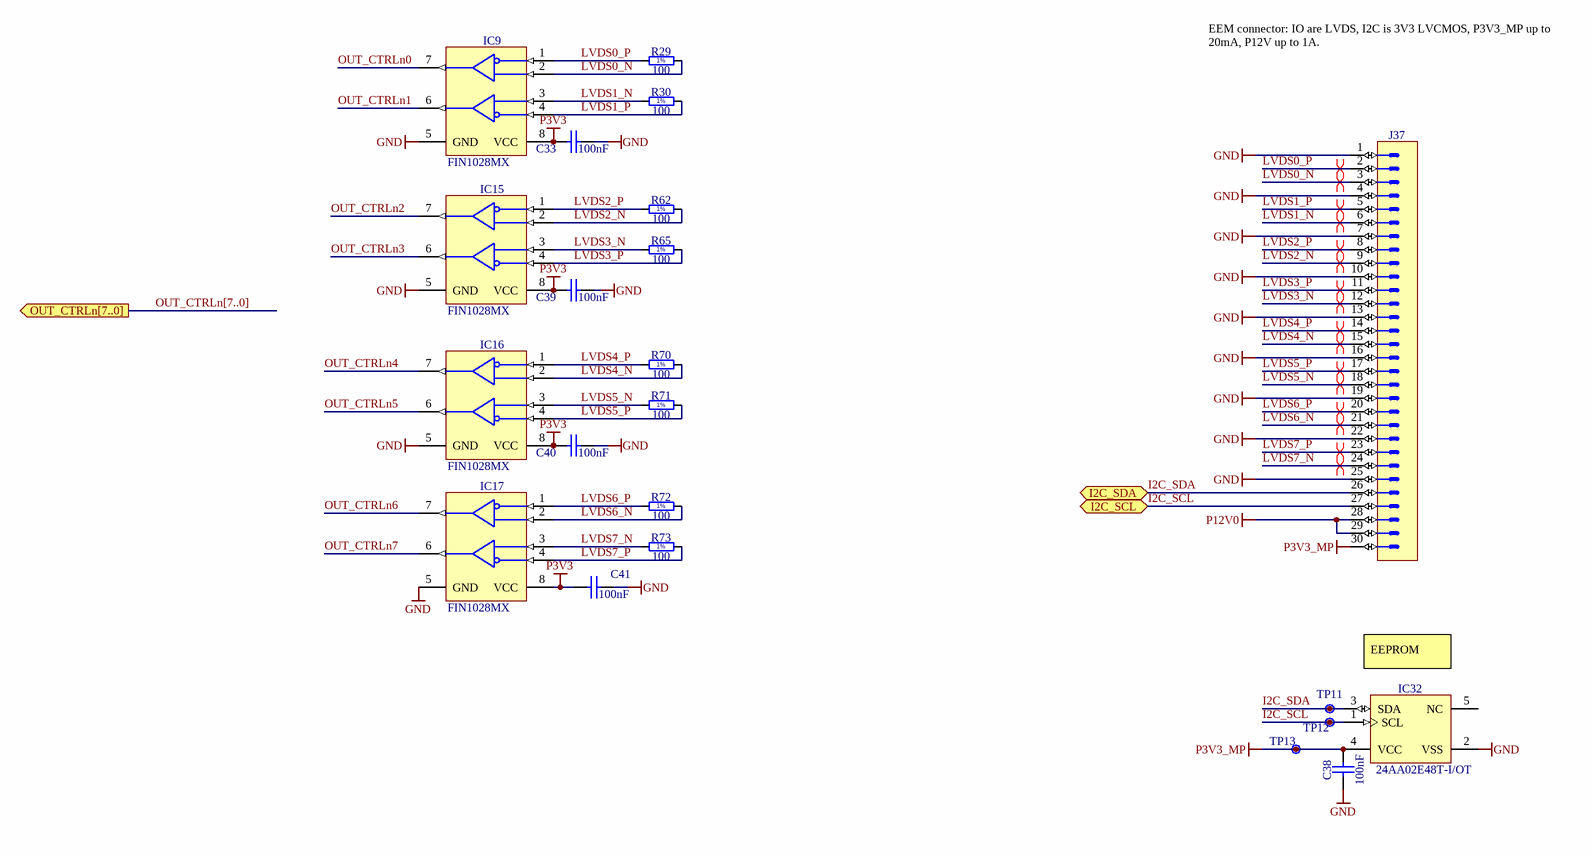
[diagram p3: LVDS_IFC_HVAMP.SchDoc]

### Parts
C33  100nF  [CAPC1005X55N]
C38  100nF  [CAPC1005X55N]
C39  100nF  [CAPC1005X55N]
C40  100nF  [CAPC1005X55N]
C41  100nF  [CAPC1005X55N]
IC9  FIN1028MX  [SOIC127P600X175-8N]
IC15  FIN1028MX  [SOIC127P600X175-8N]
IC16  FIN1028MX  [SOIC127P600X175-8N]
IC17  FIN1028MX  [SOIC127P600X175-8N]
IC32  24AA02E48T-I/OT  [SOT95P280X145-5N]
J37  (no value)  [3M_N2530-6002RB]
R29  100  [RESC1005X40N]
R30  100  [RESC1005X40N]
R62  100  [RESC1005X40N]
R65  100  [RESC1005X40N]
R70  100  [RESC1005X40N]
R71  100  [RESC1005X40N]
R72  100  [RESC1005X40N]
R73  100  [RESC1005X40N]
TP11  Test Point  [TPS127]  (value not drawn)
TP12  Test Point  [TPS127]  (value not drawn)
TP13  Test Point  [TPS127]  (value not drawn)

### Ports
I2C_SCL (bidir), I2C_SDA (bidir), OUT_CTRLn[7..0] (out)

### Nets
GND: C33.1 C38.1 C39.1 C40.1 C41.1 IC9.5(GND) IC15.5(GND) IC16.5(GND) IC17.5(GND) IC32.2(VSS) J37.1 J37.4 J37.7 J37.10 J37.13 J37.16 J37.19 J37.22 J37.25
P3V3: C33.2 C39.2 C40.2 C41.2 IC9.8(VCC) IC15.8(VCC) IC16.8(VCC) IC17.8(VCC)
P3V3_MP: C38.2 IC32.4(VCC) J37.30 TP13.1
P12V0: J37.28 J37.29
I2C_SCL: IC32.1(SCL) J37.27 TP12.1 ; port I2C_SCL
I2C_SDA: IC32.3(SDA) J37.26 TP11.1 ; port I2C_SDA
LVDS0_N: IC9.2(RIN1+) J37.3 R29.2
LVDS0_P: IC9.1(RIN1-) J37.2 R29.1
LVDS1_N: IC9.3(RIN2+) J37.6 R30.1
LVDS1_P: IC9.4(RIN2-) J37.5 R30.2
LVDS2_N: IC15.2(RIN1+) J37.9 R62.2
LVDS2_P: IC15.1(RIN1-) J37.8 R62.1
LVDS3_N: IC15.3(RIN2+) J37.12 R65.1
LVDS3_P: IC15.4(RIN2-) J37.11 R65.2
LVDS4_N: IC16.2(RIN1+) J37.15 R70.2
LVDS4_P: IC16.1(RIN1-) J37.14 R70.1
LVDS5_N: IC16.3(RIN2+) J37.18 R71.1
LVDS5_P: IC16.4(RIN2-) J37.17 R71.2
LVDS6_N: IC17.2(RIN1+) J37.21 R72.2
LVDS6_P: IC17.1(RIN1-) J37.20 R72.1
LVDS7_N: IC17.3(RIN2+) J37.24 R73.1
LVDS7_P: IC17.4(RIN2-) J37.23 R73.2
OUT_CTRLn0: IC9.7(ROUT1)
OUT_CTRLn1: IC9.6(ROUT2)
OUT_CTRLn2: IC15.7(ROUT1)
OUT_CTRLn3: IC15.6(ROUT2)
OUT_CTRLn4: IC16.7(ROUT1)
OUT_CTRLn5: IC16.6(ROUT2)
OUT_CTRLn6: IC17.7(ROUT1)
OUT_CTRLn7: IC17.6(ROUT2)

Not connected (* = marked no-connect by the designer): IC32 5(NC)

### Buses and harness runs
bus OUT_CTRLn[7..0] = port OUT_CTRLn[7..0]

### Layout directives
differential pair: LVDS0_N, LVDS0_P, LVDS1_N, LVDS1_P, LVDS2_N, LVDS2_P, LVDS3_N, LVDS3_P, LVDS4_N, LVDS4_P, LVDS5_N, LVDS5_P, LVDS6_N, LVDS6_P, LVDS7_N, LVDS7_P

### Notes on the sheet
- EEM connector: IO are LVDS, I2C is 3V3 LVCMOS, P3V3_MP up to 20mA, P12V up to 1A.
- EEPROM
- Project/Equipment
- Document
- Designer
- Drawn by
- Check.by
- Copyright WUT ISE 2020.
  This documentation describes Open Hardware and is licensed under the CERN OHL v.1.2. You may redistribute and modify this documentation under the terms of the CERN OHL v.1.2. (http://ohwr.org/CERNOHL). This documentation is distributed WITHOUT ANY EXPRESS OR IMPLIED WARRANTY, INCLUDING OF MERCHANTABILITY, SATISFACTORY QUALITY AND FITNESS FOR A PARTICULAR PURPOSE. Please see the CERN OHL v.1.2 for applicable conditions.
- Contact
- File
- Last Mod.
- Print Date
- Sheet
- Size
- A3
- of
- Rev
- (in symbol R0402_100R_1%_0.0625W_100PPM) 1%

### Library data of the parts
C33 C38-C41 = CC0402_100NF_16V_10%_X5R: as C22 on sheet power_supplies_HVAMP; Part Number: CC0402_100NF_16V_10%_X5R; Component Kind: Standard; Component Type: Standard; Pin Count: 2; Value: 100nF; Status: None; Manufacturer Part Number: CC0402_100NF_16V_10%_X5R; Case: 0402; Mounted: Yes; Socket: No; SMD: Yes; Sense: No; Manufacturer1 Example: MURATA; Manufacturer1 ComponentHeight: 0.55mm; HelpURL: \\cern.ch\dfs\Applications\Altium\Datasheets\CC0402_X5R_MURATA_GRM.pdf; Author: CERN DEM JLC; CreateDate: 10.12.2013; LatestRevisionDate: 10.12.2013
IC9 IC15-IC17 = IFC_FIN1028: 3.3V LVDS 2-Bit High-Speed Differential Reciever; Manufacturer: ON Semiconductor; PressFit: No; Bonding: No; Part Number: FIN1028MX; Component Kind: Standard; Component Type: Standard; Device: FIN1028MX; PackageDescription: SOIC 8, Pitch 1.27mm - Body 4x5mm, IPC Medium Density; Part Description: 3.3V LVDS 2-Bit High-Speed Differential Reciever; Manufacturer Part Number: FIN1028MX; Pin Count: 8; Case: SOIC8; Mounted: Yes; Socket: No; SMD: Yes; Sense: No; ComponentHeight: 0.8mm; Author: GK; HelpURL: \\cern.ch\dfs\Applications\Altium\Datasheets\FIN1101K8X.pdf; CreateDate: 08/11/2016; LatestRevisionDate: 08/11/2016
IC32 = 24AA02E48T-I/OT: 1.7V-5.5V, 2K I2C Serial EEPROM With EUI-48 Node Identity; Manufacturer: MICROCHIP TECHNOLOGY; PressFit: No; Bonding: No; Part Number: 24AA02E48T-I/OT; Component Kind: Standard; Component Type: Standard; Device: 24AA02E48T-I/OT; PackageDescription: SOT, 0.95mm pitch; 5 pin, 1.60mm W X 2.90mm L X 1.45mm H body, IPC Medium Density; Part Description: 1.7V-5.5V, 2K I2C Serial EEPROM With EUI-48 Node Identity; Manufacturer Part Number: 24AA02E48T-I/OT; Pin Count: 5; Case: SOT23-5; Mounted: Yes; Socket: No; SMD: Yes; Sense: No; ComponentHeight: 1.45mm; HelpURL: \\cern.ch\dfs\Applications\Altium\Datasheets\24AA02E48T-I-OT.pdf; Author: CERN DEM MR; CreateDate: 31.03.2016; LatestRevisionDate: 31.03.2016
J37 = 3M_N2530-6002RB: Connector 30 Male; Part Description: 30 Contacts - Straight .100'' x .100'' Low Profile Four-Wall Header, 2500 Series; Manufacturer: 3M; PressFit: No; Part Number: 3M_N2530-6002RB; Component Kind: Standard; Component Type: Standard; Pin Count: 30; Family: Header 30; Mounted: Yes; Socket: No; SMD: No; Sense: No; Status: None; Manufacturer Part Number: N2530-6002RB; ComponentHeight: 10.03mm; HelpURL: \\cern.ch\dfs\Applications\Altium\Datasheets\3M_N2530-6002RB.pdf; Author: CERN DEM JLC; CreateDate: 11.02.2009; LatestRevisionDate: 11.08.2009
R29 R30 R62 R65 R70-R73 = R0402_100R_1%_0.0625W_100PPM: Resistor - 1%; Part Description: General Purpose Thick Film Chip Resistor; Manufacturer: GENERIC; Manufacturer1 Part Number: 232270671001L; TC: ±100ppm/°C; PressFit: No; Part Number: R0402_100R_1%_0.0625W_100PPM; Component Kind: Standard; Component Type: Standard; Pin Count: 2; Value: 100; Status: Not Recommended; Power: 0.0625W; Tolerance: ±1%; Manufacturer Part Number: R0402_100R_1%_0.0625W_100PPM; Case: 0402; Mounted: Yes; Sense: No; Socket: No; SMD: Yes; Manufacturer1 Example: YAGEO PHYCOMP; Manufacturer1 ComponentHeight: 0.4mm; HelpURL: \\cern.ch\dfs\Applications\Altium\Datasheets\R0402_Phycomp_RC0402.pdf; Author: CERN DEM JLC; CreateDate: 03.12.2007; LatestRevisionDate: 17.10.2012
TP11-TP13 = SMD_PAD_1.27X1.27MM: as TP1 on sheet power_supplies_HVAMP; Part Number: SMD_PAD_1.27X1.27MM; Component Kind: Standard (No BOM); Component Type: Standard (No BOM); Pin Count: 1; Family: Test Point; Socket: No; SMD: Yes; Sense: No; Status: None; ComponentHeight: 0mm; HelpURL: Undefined; Author: CERN DEM JLC; CreateDate: 12.01.2008; LatestRevisionDate: 12.01.2008; PackageDescription: 1.27mm x 1.27mm PCB Copper Area (SMD Test Point)